# EAGLE design Reverse Geocache schematic v0.3 (EAGLE 5.11)
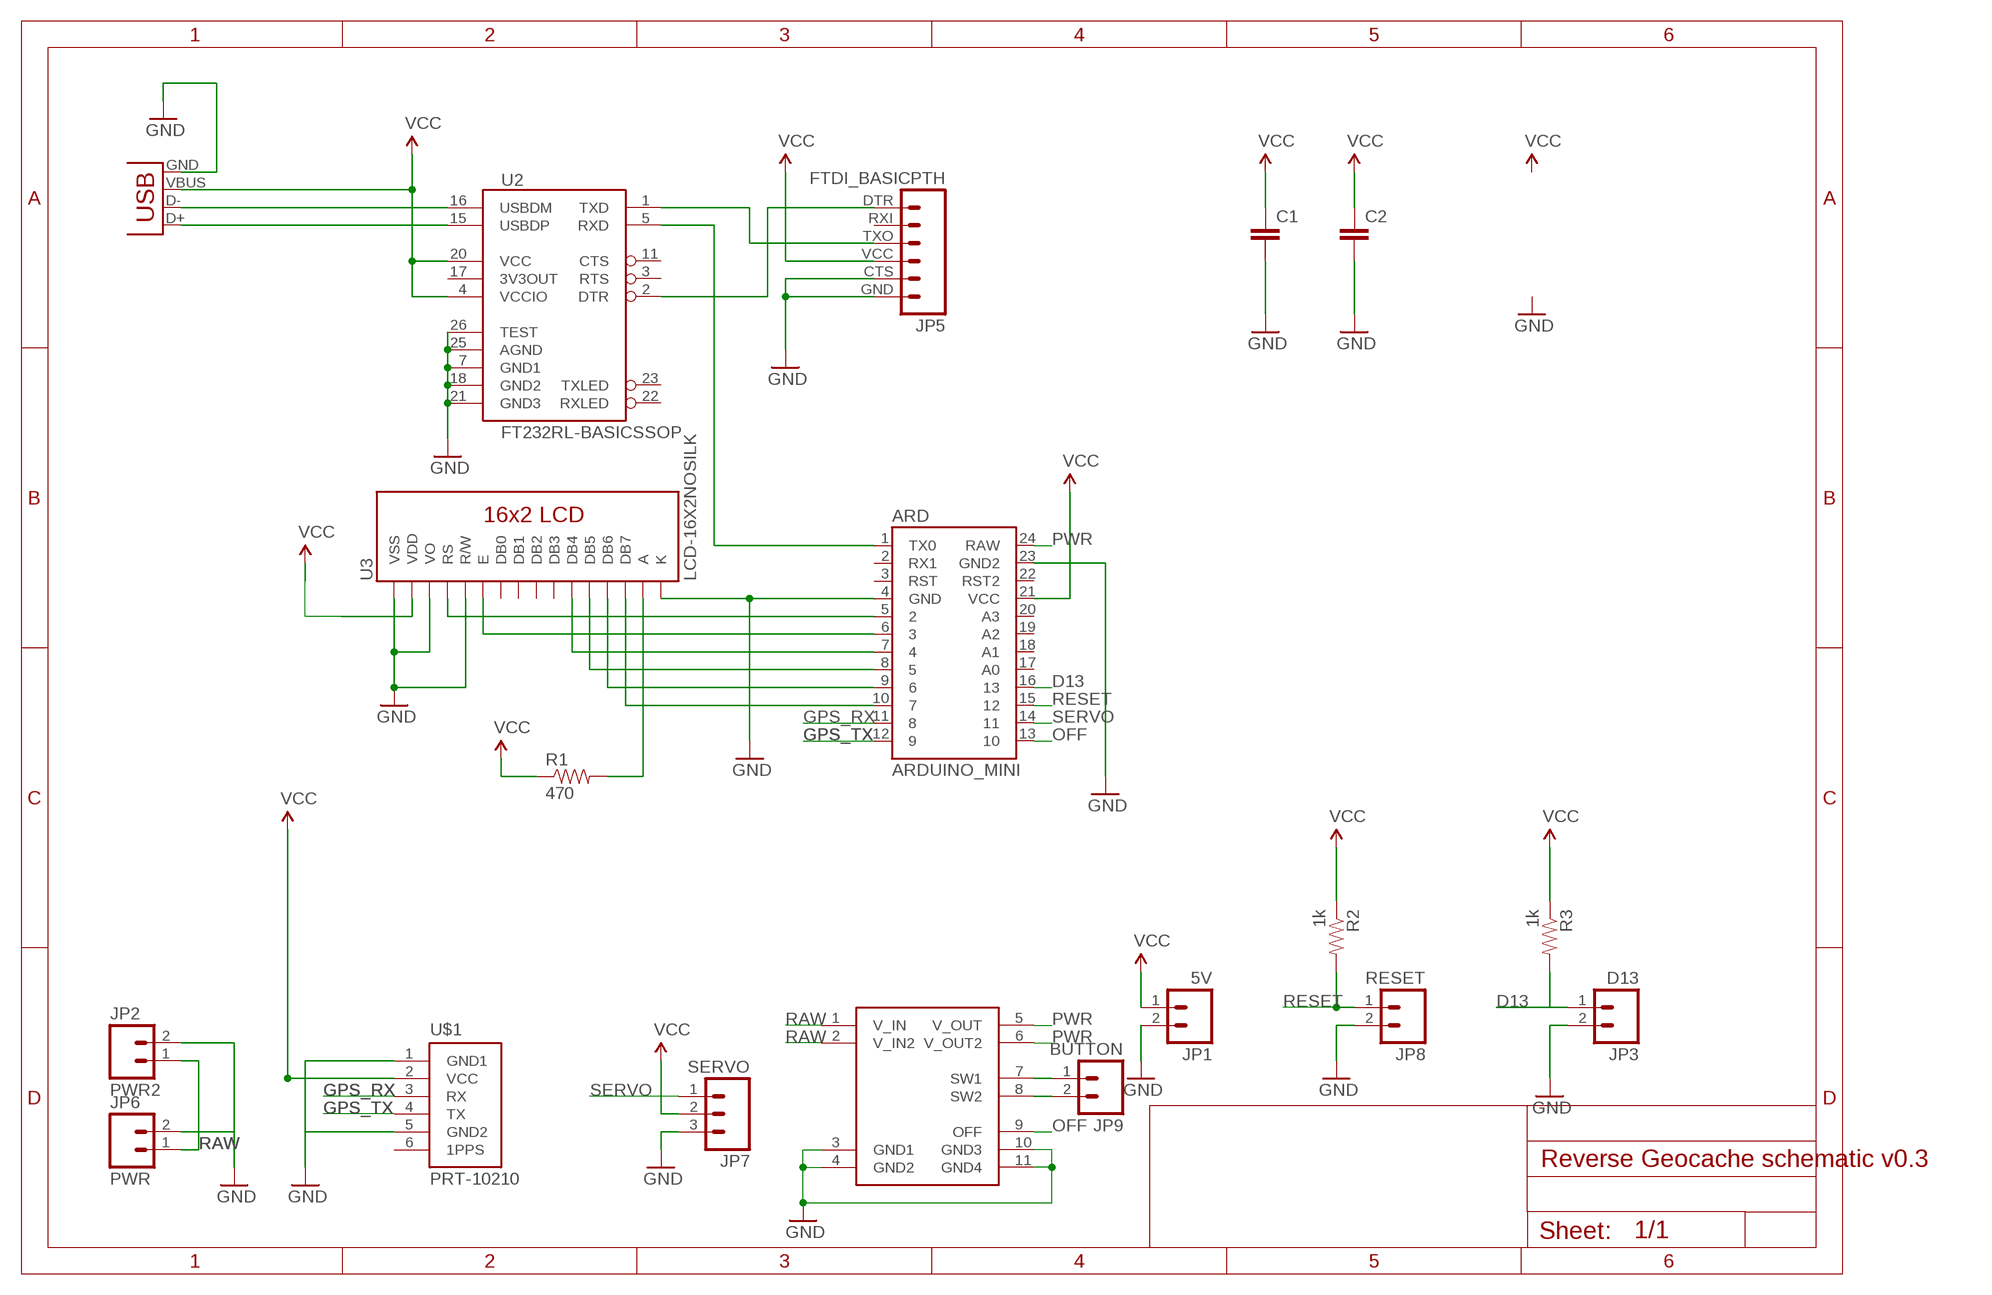
[diagram p0: schematic, sheet 1]

## Parts
ARD  ARDUINO_MINI  [ARDUINO_MINI]
C1  C10/4  [C10B4]
C2  C10/4  [C10B4]
JP1  5V  M02PTH  [1X02]
JP2  PWR2  M02PTH  [1X02]
JP3  D13  M02PTH  [1X02]
JP5  FTDI_BASICPTH  [FTDI_BASIC]
JP6  PWR  M02POLAR  [MOLEX-1X2]
JP7  SERVO  M03PTH  [1X03]
JP8  RESET  M02PTH  [1X02]
JP9  BUTTON  M02PTH  [1X02]
R1  470  RESISTORPTH-1/4W  [AXIAL-0.4]
R2  1k  RESISTORPTH-1/4W  [AXIAL-0.4]
R3  1k  RESISTORPTH-1/4W  [AXIAL-0.4]
U2  FT232RL-BASICSSOP  [SSOP28DB]
U3  LCD-16X2NOSILK  [LCD-16X2_NOSILK]
U$1  PRT-10210  [PRT-10210]
U$2  ROB-08903  [ROB-08903]
X1  USBPTH-VERTICAL  [USB-B-PTH-VERTICAL]

## Nets
D13: ARD.16 JP3.1 R3.P$2
GND: C1.2 C2.2 U$2.3(GND1) U$2.4(GND2) U$2.10(GND3) U$2.11(GND4)
GPS_RX: ARD.11 U$1.3(RX)
GPS_TX: ARD.12 U$1.4(TX)
N$1: U2.16(USBDM) X1.D-
N$2: U2.15(USBDP) X1.D+
N$3: ARD.4(GND) ARD.23(GND2) JP1.2 JP2.2 JP3.2 JP5.CTS JP5.GND JP6.2 JP7.3 JP8.2 U2.7(GND1) U2.18(GND2) U2.21(GND3) U2.25(AGND) U2.26(TEST) U3.1(VSS) U3.3(VO) U3.5(R/W) U3.16(K) U$1.1(GND1) U$1.5(GND2) X1.GND ; supply symbol labelled GND
N$4: ARD.5 U3.4(RS)
N$5: JP5.TXO U2.1(TXD)
N$6: ARD.1(TX0) U2.5(RXD)
N$8: JP5.DTR U2.2(DTR)
N$10: R1.P$2 U3.15(A)
N$11: JP9.1 U$2.7(SW1)
N$12: ARD.6 U3.6(E)
N$13: ARD.7 U3.11(DB4)
N$14: ARD.8 U3.12(DB5)
N$15: ARD.9 U3.13(DB6)
N$16: ARD.10 U3.14(DB7)
N$17: JP9.2 U$2.8(SW2)
OFF: ARD.13 U$2.9(OFF)
PWR: ARD.24(RAW) U$2.5(V_OUT) U$2.6(V_OUT2)
RAW: JP2.1 JP6.1 U$2.1(V_IN) U$2.2(V_IN2)
RESET: ARD.15 JP8.1 R2.P$2
SERVO: ARD.14 JP7.1
VCC: ARD.21(VCC) C1.1 C2.1 JP1.1 JP5.VCC JP7.2 R1.P$1 R2.P$1 R3.P$1 U2.4(VCCIO) U2.20(VCC) U3.2(VDD) U$1.2(VCC) X1.VBUS
Unconnected: ARD.2(RX1) ARD.3(RST) ARD.17(A0) ARD.18(A1) ARD.19(A2) ARD.20(A3) ARD.22(RST2) JP5.RXI U2.3(RTS) U2.11(CTS) U2.17(3V3OUT) U2.22(RXLED) U2.23(TXLED) U3.7(DB0) U3.8(DB1) U3.9(DB2) U3.10(DB3) U$1.6(1PPS)

## Library data of the parts
ARD = SparkFun:ARDUINO_MINI
C1 C2 = capacitor-wima:C: CAPACITOR naming: grid - package width
JP1-JP3 JP6 JP8 JP9 = SparkFun:M02: Header 2 Standard 2-pin 0.1" header. Use with straight break away headers (SKU : PRT-00116), right angle break away headers (PRT-00553), swiss pins (PRT-00743), machine pins (PRT-00117), and female headers (PRT-00115). Molex polarized connector foot print use with SKU : PRT-08233 with associated crimp pins and housings.
JP5 = SparkFun:FTDI_BASIC: FTDI Basic: 3.3V and 5V
JP7 = SparkFun:M03: Header 3 Standard 3-pin 0.1" header. Use with straight break away headers (SKU : PRT-00116), right angle break away headers (PRT-00553), swiss pins (PRT-00743), machine pins (PRT-00117), and female headers (PRT-00115). Molex polarized connector foot print use with SKU : PRT-08232 with associated crimp pins and housings.
R1-R3 = SparkFun:RESISTOR: Resistor Basic schematic elements and footprints for 0603, 1206, and PTH resistors.
U2 = SparkFun:FT232RL-BASIC: USB UART This is the simplified version of the FT232RL unit. Only what you need, nothing you don't. Spark Fun Electronics SKU : COM-00650
U3 = SparkFun:LCD-16X2
U$1 = Custom:PRT-10210: 6-Pin connector Sparkfun sku: PRT-10210
U$2 = Custom:ROB-08903: Pololu pushbutton power switch Sparkfun sku: ROB-08903
X1 = SparkFun:USB: USB Connectors USB-B-PTH is fully proven SKU : PRT-00139 USB-miniB is fully proven SKU : PRT-00587 USB-A-PCB is untested. USB-A-H is throughly reviewed, but untested. Spark Fun Electronics SKU : PRT-00437 USB-B-SMT is throughly reviewed, but untested. Needs silkscreen touching up. USB-A-S has not been used/tested USB-MB-H has not been used/tested

## Board
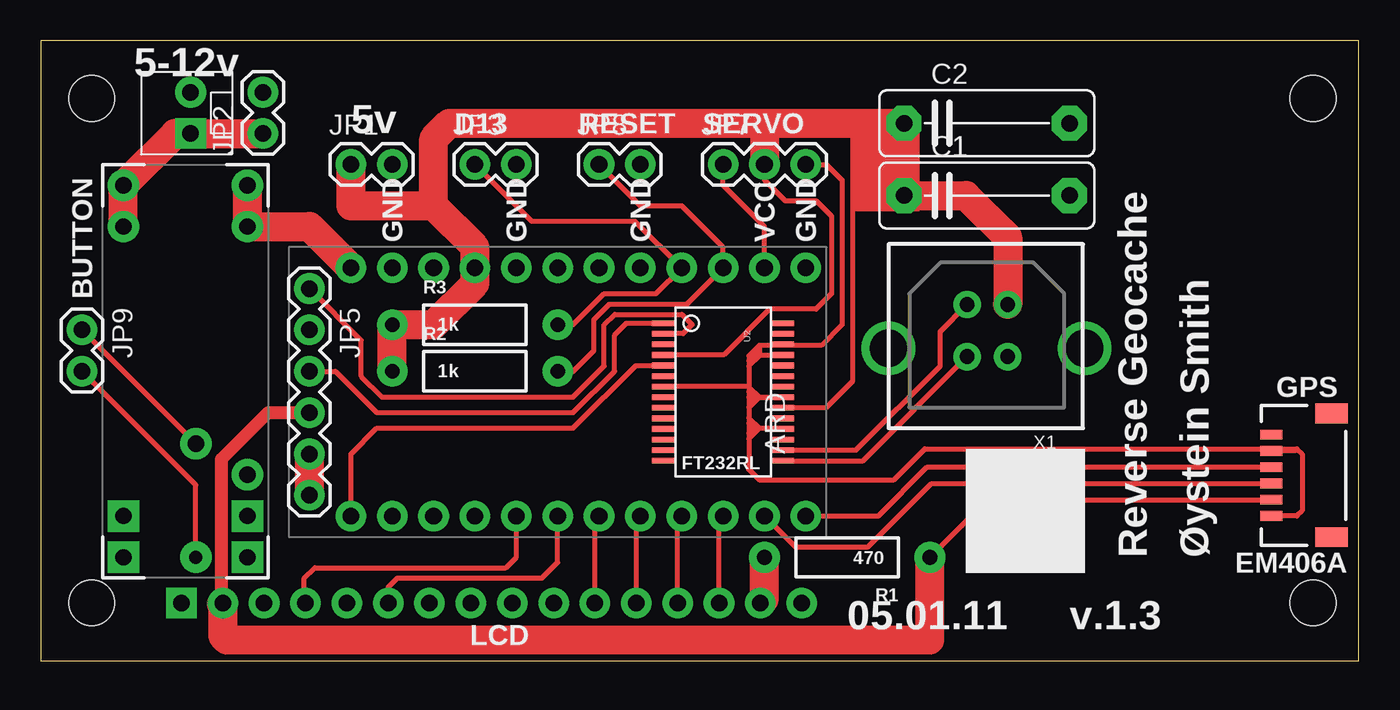
[diagram p1: board, top side]
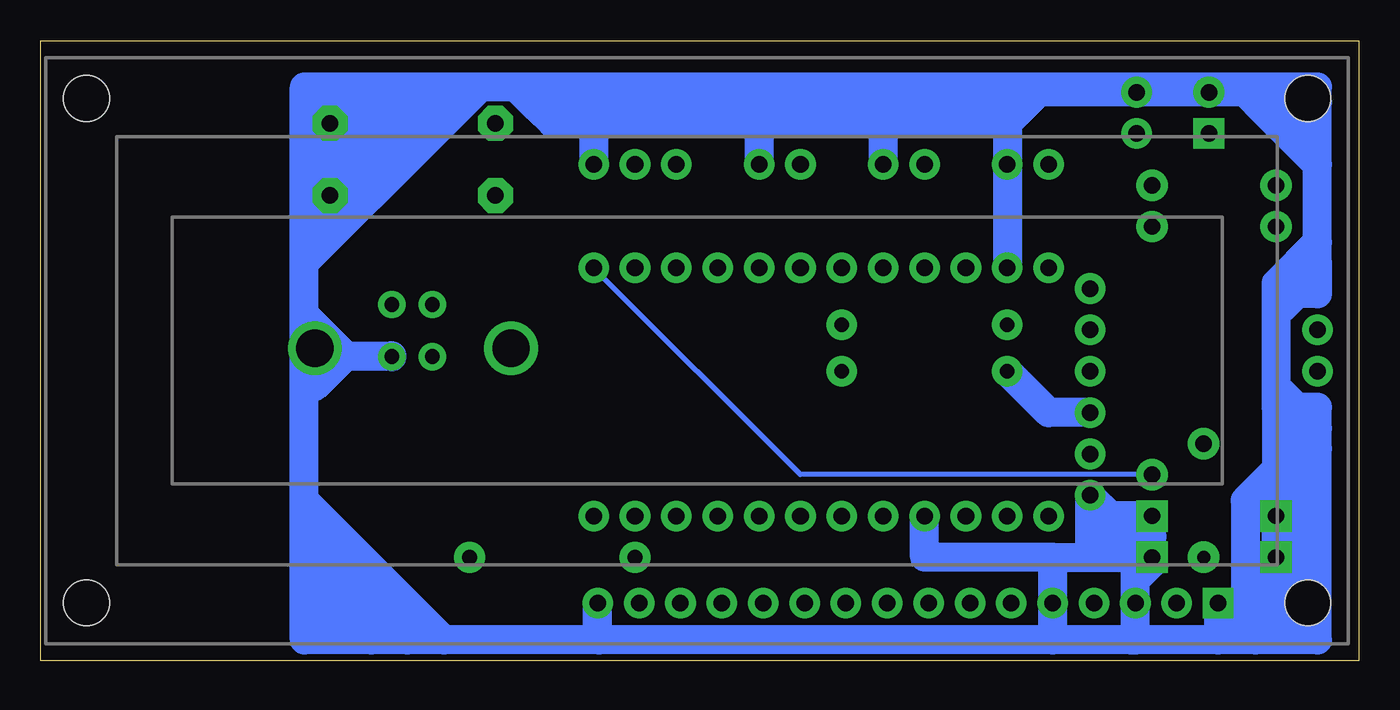
[diagram p2: board, bottom side, seen from below]

Size 80.95 x 38.09 mm. Coordinates in mm from the lower left corner, seen from the top.
Outline: 0,0 80.95,0 80.95,38.09 0,38.09 0,0
Copper layers (1*16): Top 0.035mm / dielectric 1.5mm / Bottom 0.035mm
Design rules "default": minimum track width 10mil, minimum drill 24mil, track to track 8mil, track to pad 8mil, pad to pad 8mil, via to via 8mil, smd to smd 8mil, copper to edge 40mil, drill to drill 8mil, minimum pad ring 10mil, minimum via ring 8mil, stop-mask expansion 4mil, vias tented up to drill 0mil, thermal gap 10mil

### Footprints (pad centres in the part's own frame; a part is rotated, then mirrored left to right if it is on the bottom)
ARDUINO_MINI = drill 1.016 pad 1.88 round: 1 -7.62,12.7; 2 -7.62,10.16; 3 -7.62,7.62; 4 -7.62,5.08; 5 -7.62,2.54; 6 -7.62,0; 7 -7.62,-2.54; 8 -7.62,-5.08; 9 -7.62,-7.62; 10 -7.62,-10.16; 11 -7.62,-12.7; 12 -7.62,-15.24; 13 7.62,-15.24; 14 7.62,-12.7; 15 7.62,-10.16; 16 7.62,-7.62; 17 7.62,-5.08; 18 7.62,-2.54; 19 7.62,0; 20 7.62,2.54; 21 7.62,5.08; 22 7.62,7.62; 23 7.62,10.16; 24 7.62,12.7
C10B4 = drill 1.016 pad 2.159 octagon: 1 -5.08,0; 2 5.08,0
1X02 = drill 1.016 pad 1.88 round: 1 0,0; 2 2.54,0
FTDI_BASIC = drill 1.016 pad 1.88 round: CTS 10.16,0; DTR 0,0; GND 12.7,0; RXI 2.54,0; TXO 5.08,0; VCC 7.62,0
MOLEX-1X2 = drill 1.016 pad 1.88 square: 1 0,0 | drill 1.016 pad 1.88 round: 2 2.54,0
1X03 = drill 1.016 pad 1.88 round: 1 0,0; 2 2.54,0; 3 5.08,0
AXIAL-0.4 = drill 0.9 pad 1.88 round: P$1 -5.08,0; P$2 5.08,0
SSOP28DB = smd 0.348 x 1.397: 1 -4.225,-3.656; 2 -3.575,-3.656; 3 -2.925,-3.656; 4 -2.275,-3.656; 5 -1.625,-3.656; 6 -0.975,-3.656; 7 -0.325,-3.656; 8 0.325,-3.656; 9 0.975,-3.656; 10 1.625,-3.656; 11 2.275,-3.656; 12 2.925,-3.656; 13 3.575,-3.656; 14 4.225,-3.656; 15 4.225,3.656; 16 3.575,3.656; 17 2.925,3.656; 18 2.275,3.656; 19 1.625,3.656; 20 0.975,3.656; 21 0.325,3.656; 22 -0.325,3.656; 23 -0.975,3.656; 24 -1.625,3.656; 25 -2.275,3.656; 26 -2.925,3.656; 27 -3.575,3.656; 28 -4.225,3.656
LCD-16X2_NOSILK = drill 1.016 pad 1.88 square: 1 -32,15.5 | drill 1.016 pad 1.88 round: 2 -29.46,15.5; 3 -26.92,15.5; 4 -24.38,15.5; 5 -21.84,15.5; 6 -19.3,15.5; 7 -16.76,15.5; 8 -14.22,15.5; 9 -11.68,15.5; 10 -9.14,15.5; 11 -6.6,15.5; 12 -4.06,15.5; 13 -1.52,15.5; 14 1.02,15.5; 15 3.56,15.5; 16 6.1,15.5 | hole 2.8: -37.5,15.5; -37.5,-15.5; 37.5,15.5; 37.5,-15.5
PRT-10210 = smd 0.6 x 1.35: 1 0,0; 2 1,0; 3 2,0; 4 3,0; 5 4,0; 6 5,0 | smd 1.2 x 2: NC1 -1.3,-3.7; NC2 6.3,-3.7
ROB-08903 = drill 1 pad 1.93 round: 1 0,22.86; 2 0,20.32; 5 7.62,22.86; 6 7.62,20.32; 7 4.445,6.985; 9 7.62,5.08 | drill 1 pad 1.93 square: 3 0,2.54; 4 0,0; 10 7.62,2.54; 11 7.62,0 | drill 0.8 pad 1.93 round: 8 4.445,0
USB-B-PTH-VERTICAL = drill 0.914 pad 1.676 round: D+ 4.826,4.394; D- 4.826,7.595; GND 7.315,4.394; VBUS 7.315,7.595 | drill 2.286 round: P$1 0,4.902; P$2 12.04,4.902

### Placement (x,y rotation side)
ARD  31.75,16.51 90 top
C1  58.1,28.57 0 top
C2  58.1,33.02 0 top
JP1  19.05,30.48 0 top
JP2  13.65,32.38 90 top
JP3  26.67,30.48 0 top
JP5  16.51,22.86 270 top
JP6  9.21,32.38 90 top
JP7  41.91,30.48 0 top
JP8  34.29,30.48 0 top
JP9  2.54,20.32 270 top
R1  49.53,6.35 180 top
R2  26.67,17.78 0 top
R3  26.67,20.64 0 top
U2  41.91,16.51 270 top
U3  40.64,19.05 180 bottom
U$1  75.56,8.89 90 top
U$2  5.08,6.35 0 top
X1  52.07,14.29 0 top

### Tracks (layer width: path | path; a pad name or v marks a point on that pad's centre or on a via)
D13
  Top 0.305: JP3.1 30.16,26.99 36.51,26.99 ARD.16 37.78,22.54 34.61,22.54 32.7,20.64 R3.P$2
GND
  Bottom 1.778: C2.2 C1.2 63.18,27.94 64.77,27.94 64.77,1.27 13.97,1.27 | 12.7,7.62 U$2.10 15.24,8.89 16.51,10.16 16.51,7.62 | 16.51,7.62 12.7,7.62 | U$2.11 12.7,7.62 | U$2.11 12.7,5.97 13.72,4.95 13.72,1.52 13.97,1.27 | 13.72,1.27 8.64,1.27 8.64,3.56 7.24,3.56 | 13.72,1.27 13.97,1.27 | 7.24,3.56 7.24,1.65 | U$2.3 U$2.4 5.08,3.56 7.24,3.56 | 16.51,7.62 16.51,6.35 13.72,6.35 | 13.72,6.35 U$2.11 | 13.72,1.27 13.72,6.35
GPS_RX
  Top 0.305: ARD.11 46.35,6.98 50.8,6.98 54.7,10.89 U$1.3
GPS_TX
  Top 0.305: ARD.12 51.44,8.89 54.44,11.89 U$1.4
N$1
  Top 0.305: U2.16 50.08,12.93 55.24,18.1 55.24,20.23 X1.D-
N$2
  Top 0.305: U2.15 50.5,12.29 X1.D+
N$3
  Top 0.305: U2.7 43.49,16.84 43.5,16.83 | 43.5,18.1 43.5,16.83 | 43.5,18.41 43.5,18.73 43.55,18.79 | 44.13,19.37 43.55,18.79 | 45.5,19.37 44.13,19.37 | 45.5,19.37 U2.26 | 43.55,18.79 U2.25 | 43.5,16.83 44.13,16.19 | 44.13,16.19 45.56,16.19 U2.21 44.14,16.18 44.13,16.19 | 44.13,16.19 43.81,15.88 | 43.81,15.88 43.5,15.56 | 43.5,15.56 43.5,14.92 | 43.5,14.92 44.13,14.29 | 44.13,14.29 45.51,14.29 U2.18 | 43.5,16.19 43.5,15.56 | 43.5,16.51 43.5,16.19 | 43.5,16.83 43.5,16.51 | 43.5,16.51 43.81,16.19 | 43.5,16.19 43.81,15.88 | 44.13,18.73 43.5,18.1 | 43.5,18.41 43.5,18.1 | 43.81,18.73 43.5,18.41 | 44.13,18.73 43.81,18.73 | 44.13,19.05 44.13,18.73 | 44.13,19.37 44.13,19.05 | 44.13,19.05 43.81,18.73 | 45.5,19.37 47.94,19.37 49.21,20.64 49.21,29.53 48.26,30.48 JP7.3 | 43.5,14.92 43.5,14.61 | 43.5,14.61 43.5,13.97 | 43.5,13.65 43.5,11.75 44.13,11.11 52.39,11.11 54.29,13.02 77.15,13.02 | 77.15,13.02 77.47,12.7 77.47,9.21 77.15,8.89 U$1.1 | 44.13,14.29 43.5,13.65 | 43.5,13.97 43.5,13.65 | 43.5,13.97 43.81,14.29 43.5,14.61 | 77.15,13.02 77.03,12.89 U$1.5
  Top 1.778: JP5.GND JP5.CTS
  Bottom 1.778: 59.44,18.73 59.37,18.73 | 62.23,18.73 64.45,18.73 64.45,16.83 64.14,16.83 62.23,18.73 | 6.35,1.27 2.54,1.27 2.54,13.02 | 56.2,1.27 58.42,1.27 | 60.64,1.27 64.77,1.27 64.77,7.62 | 64.77,9.84 64.77,18.1 | 64.77,18.1 64.77,20 | 64.77,20 64.77,21.27 | 64.77,21.27 64.77,24.45 | 64.77,24.45 64.77,25.4 | 2.54,34.29 6.35,34.29 3.49,31.43 3.49,33.02 3.81,33.34 | 36.83,33.02 29.21,33.02 | 46.99,33.02 36.83,33.02 | 46.99,33.02 JP7.3 | 13.72,1.27 18.8,1.27 | 18.8,1.27 46.67,1.27 | 46.67,1.27 56.2,1.27 | 6.35,1.27 13.72,1.27 | 6.35,1.27 6.35,6.35 5.08,6.35 5.08,3.55 | ARD.4 26.67,6.35 18.8,6.35 | U3.5 | U3.16 46.74,1.34 46.67,1.27 | ARD.23 JP1.2 21.59,33.02 | 18.8,6.35 16.51,6.35 | 36.83,33.02 36.83,33.66 | 36.83,33.02 JP8.2 | 29.21,33.02 JP3.2 | 2.54,13.02 2.54,14.29 | 2.54,14.29 5.08,16.83 | 5.08,16.83 5.08,22.54 | 5.08,22.54 5.08,22.86 | 5.08,22.86 2.54,22.86 | 2.54,24.45 2.54,22.86 | 2.54,14.29 2.54,15.56 4.76,15.56 | 4.76,21.59 3.81,22.54 2.54,22.54 2.54,22.86 | 2.54,24.45 4.45,22.54 5.08,22.54 | 2.54,24.45 2.54,25.72 | 2.54,25.72 2.54,30.48 | 2.54,30.48 2.54,34.29 | 2.54,34.29 2.54,35.24 49.21,35.24 | 64.77,27.3 64.77,35.24 53.98,35.24 | 16.51,6.35 JP5.GND | 16.51,6.35 13.97,6.35 | 64.77,18.1 64.14,18.1 63.18,19.05 63.18,19.37 63.82,20 64.77,20 | 64.77,21.27 62.23,18.73 | 59.44,18.73 X1.GND | 62.23,18.73 59.44,18.73 | 64.77,25.4 57.78,32.38 | 64.77,25.4 64.77,27.3 | 64.77,27.3 60.33,31.75 | 60.33,31.75 59.69,32.38 | 60.33,31.75 62.23,31.75 | 29.21,34.29 29.53,33.97 50.48,33.97 | 51.75,35.24 50.48,33.97 | 51.75,35.24 53.98,35.24 | 56.83,32.38 53.98,35.24 | 64.77,24.45 56.83,32.38 | 56.83,32.38 56.83,33.97 63.82,33.97 63.82,33.02 63.5,32.7 58.42,32.7 | 46.99,33.02 49.53,33.02 50.48,33.97
  Bottom 1.778: 49.21,35.24 51.75,35.24 | 49.21,35.24 46.99,33.02 | 56.2,1.27 64.77,9.84 | 64.77,9.84 64.77,7.62 | 58.42,1.27 64.77,7.62 | 58.42,1.27 60.64,1.27 | 60.64,1.27 64.45,5.08 64.45,3.49 63.18,2.22 | 18.8,1.27 U3.5 | U3.5 18.8,6.35 | U3.3 13.72,1.27 | 5.08,3.55 U3.1 | 5.08,3.55 5.08,2.54 3.81,2.54 3.81,8.89 | 2.54,25.72 5.08,23.18 5.08,22.86 | 5.08,15.56 5.08,16.83 | 2.54,13.02 5.08,15.56 | 5.08,15.56 5.08,11.75 | 5.08,11.75 5.08,10.48 4.76,10.16 3.81,10.16 3.81,13.02 | 6.99,3.49 6.99,9.84 5.08,11.75 | 2.54,30.48 6.99,34.93 JP6.2 JP2.2 19.68,34.93 21.59,33.02 | 21.59,33.02 29.21,33.02 | 29.21,33.02 29.21,34.29 | 29.21,34.29 21.59,34.29
N$4
  Top 0.305: ARD.5 29.21,6.35 28.57,5.71 16.83,5.71 16.19,5.08 16.19,3.62 U3.4
N$5
  Top 0.305: U2.1 35.98,20.73 35.24,20 35.24,17.78 32.7,15.24 20.64,15.24 18.1,17.78 JP5.TXO
N$6
  Top 0.305: U2.5 36.55,18.13 32.7,14.29 20.64,14.29 19.05,12.7 ARD.1
N$8
  Top 0.305: U2.2 39.45,20.09 40.01,20.64 39.37,21.27 35.24,21.27 34.61,20.64 34.61,18.1 32.7,16.19 20.95,16.19 19.68,17.46 19.68,19.68 JP5.DTR
N$10
  Top 1.778: R1.P$2 44.45,3.8 U3.15
N$11
  Top 0.305: U$2.7 JP9.1
N$12
  Top 0.305: U3.6 21.34,4.51 21.91,5.08 30.8,5.08 31.75,6.03 ARD.6
N$13
  Top 0.305: U3.11 34.04,8.64 ARD.7
N$14
  Top 0.305: U3.12 36.58,8.64 ARD.8
N$15
  Top 0.305: U3.13 39.12,8.64 ARD.9
N$16
  Top 0.305: U3.14 41.66,8.64 ARD.10
N$17
  Top 0.305: U$2.8 9.53,10.79 JP9.2
OFF
  Bottom 0.305: U$2.9 34.29,11.43 ARD.13
PWR
  Top 1.778: U$2.5 U$2.6 16.51,26.67 ARD.24
RAW
  Top 1.778: JP2.1 JP6.1 8.26,32.38 U$2.1 U$2.2
RESET
  Top 0.305: JP8.1 36.83,27.94 39.37,27.94 41.91,25.4 ARD.15 39.69,21.91 34.92,21.91 33.97,20.95 33.97,19.05 32.7,17.78 R2.P$2
SERVO
  Top 0.305: JP7.1 41.91,29.21 44.45,26.67 ARD.14
VCC
  Top 0.305: JP7.2 44.45,29.53 45.72,28.26 47.62,28.26 48.58,27.3 48.58,22.54 47.62,21.59 44.77,21.59 41.96,18.79 U2.4 | U2.20 48.24,15.54 49.85,17.14 49.85,33.02 | R1.P$1 58.15,9.89 U$1.2
  Top 0.813: JP5.VCC 13.97,15.24 11.11,12.38 11.11,3.49
  Top 1.778: R1.P$1 54.61,1.27 11.43,1.27 11.18,1.52 U3.2 11.11,3.49 | 44.45,33.02 JP7.2 | 44.45,33.02 49.85,33.02 C2.1 C1.1 56.83,28.57 59.38,26.02 X1.VBUS | JP1.1 19.05,27.94 24.13,27.94 | R2.P$1 R3.P$1 24.13,20.64 26.67,23.18 ARD.21 26.67,25.4 24.13,27.94 | 24.13,27.94 24.13,32.07 25.08,33.02 44.45,33.02
  Bottom 1.778: JP5.VCC 19.05,15.24 R2.P$1
(copper drawn outside any net)
  shapes: Top area x1

### Text on the board
tPlace: 5-12v | 5v | D13 | RESET | SERVO | GND | GND | GND | VCC | GND | BUTTON | GPS | FT232RL | Reverse Geocache | Øystein Smith | EM406A | 05.01.11 | v.1.3 | LCD